# Altium schematic sheet Isolation.SchDoc
size A4
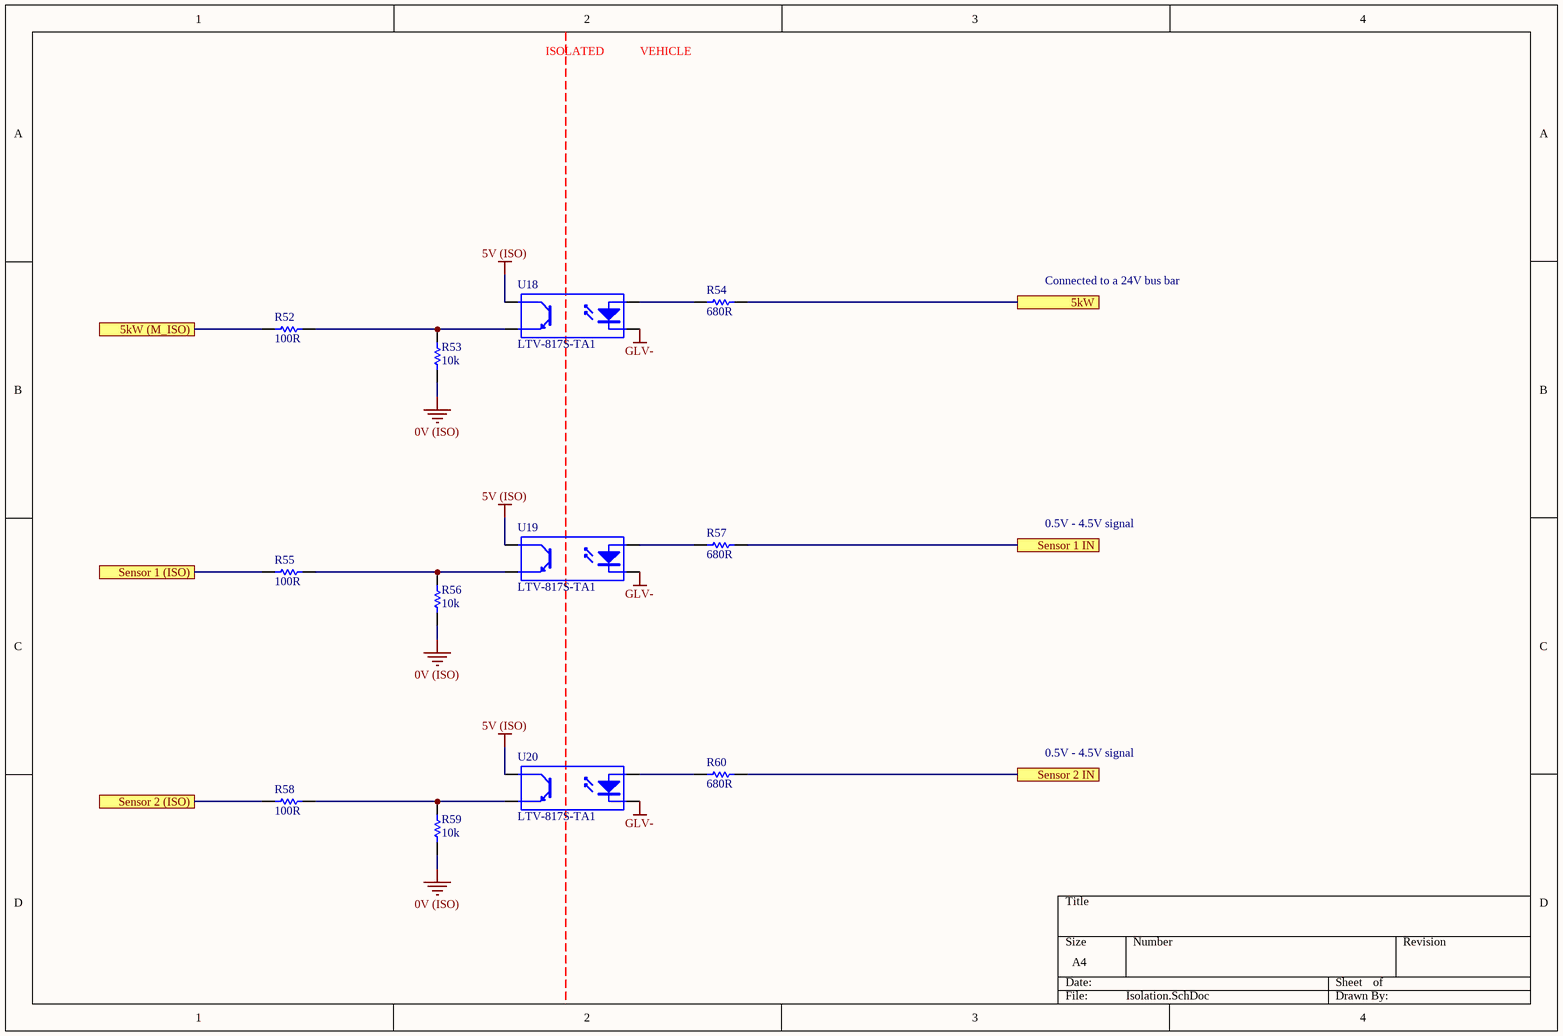
[diagram p0: Isolation.SchDoc]

## Parts
R52  100R  [0805]
R53  10k  [0805]
R54  680R  [0805]
R55  100R  [0805]
R56  10k  [0805]
R57  680R  [0805]
R58  100R  [0805]
R59  10k  [0805]
R60  680R  [0805]
U18  LTV-817S-TA1  [ON 4-SMD]
U19  LTV-817S-TA1  [ON 4-SMD]
U20  LTV-817S-TA1  [ON 4-SMD]

## Ports
5kW, 5kW (M_ISO), Sensor 1 (ISO), Sensor 1 IN, Sensor 2 (ISO), Sensor 2 IN

## Nets
0V (ISO): R53.1 R56.1 R59.1
5V (ISO): U18.4(C) U19.4(C) U20.4(C)
GLV-: U18.2(K) U19.2(K) U20.2(K)
5kW: R54.2 ; port 5kW
5kW (M_ISO): R52.1 ; port 5kW (M_ISO)
Sensor 1 (ISO): R55.1 ; port Sensor 1 (ISO)
Sensor 1 IN: R57.2 ; port Sensor 1 IN
Sensor 2 (ISO): R58.1 ; port Sensor 2 (ISO)
Sensor 2 IN: R60.2 ; port Sensor 2 IN
NetR52_2: R52.2 R53.2 U18.3(E)
NetR54_1: R54.1 U18.1(A)
NetR55_2: R55.2 R56.2 U19.3(E)
NetR57_1: R57.1 U19.1(A)
NetR58_2: R58.2 R59.2 U20.3(E)
NetR60_1: R60.1 U20.1(A)

## Notes on the sheet
- ISOLATED
- VEHICLE
- Connected to a 24V bus bar
- 0.5V - 4.5V signal

## Library data of the parts
R52 R55 R58 = RC0805FR07100RL: Manufacturer: YAGEO; Tolerance: 0.01; Rated Voltage: 0.125W; Part Number: RC0805FR07100RL; Value: 100R; Material: FR-07
R53 R56 R59 = RC0805FR0710KL: Manufacturer: YAGEO; Tolerance: 0.01; Rated Voltage: 0.125W; Part Number: RC0805FR0710KL; Value: 10k; Material: FR-07
R54 R57 R60 = RC0805FR07680RL: Manufacturer: YAGEO; Tolerance: 0.01; Rated Voltage: 0.125W; Part Number: RC0805FR07680RL; Value: 680R; Material: FR-07
U18-U20 = LTV-817S-TA1: 35V 50ma Optocoupler (VF=1.2V); Manufacturer: Lite-On Inc; Part Number: LTV-817S-TA1; Digikey Part Number: 160-1893-2-ND; Digikey Link: https://www.digikey.com/product-detail/en/lite-on-inc/LTV-817S-TA1/160-1893-2-ND/388451